# EAGLE design em18 (EAGLE 7.4.0)
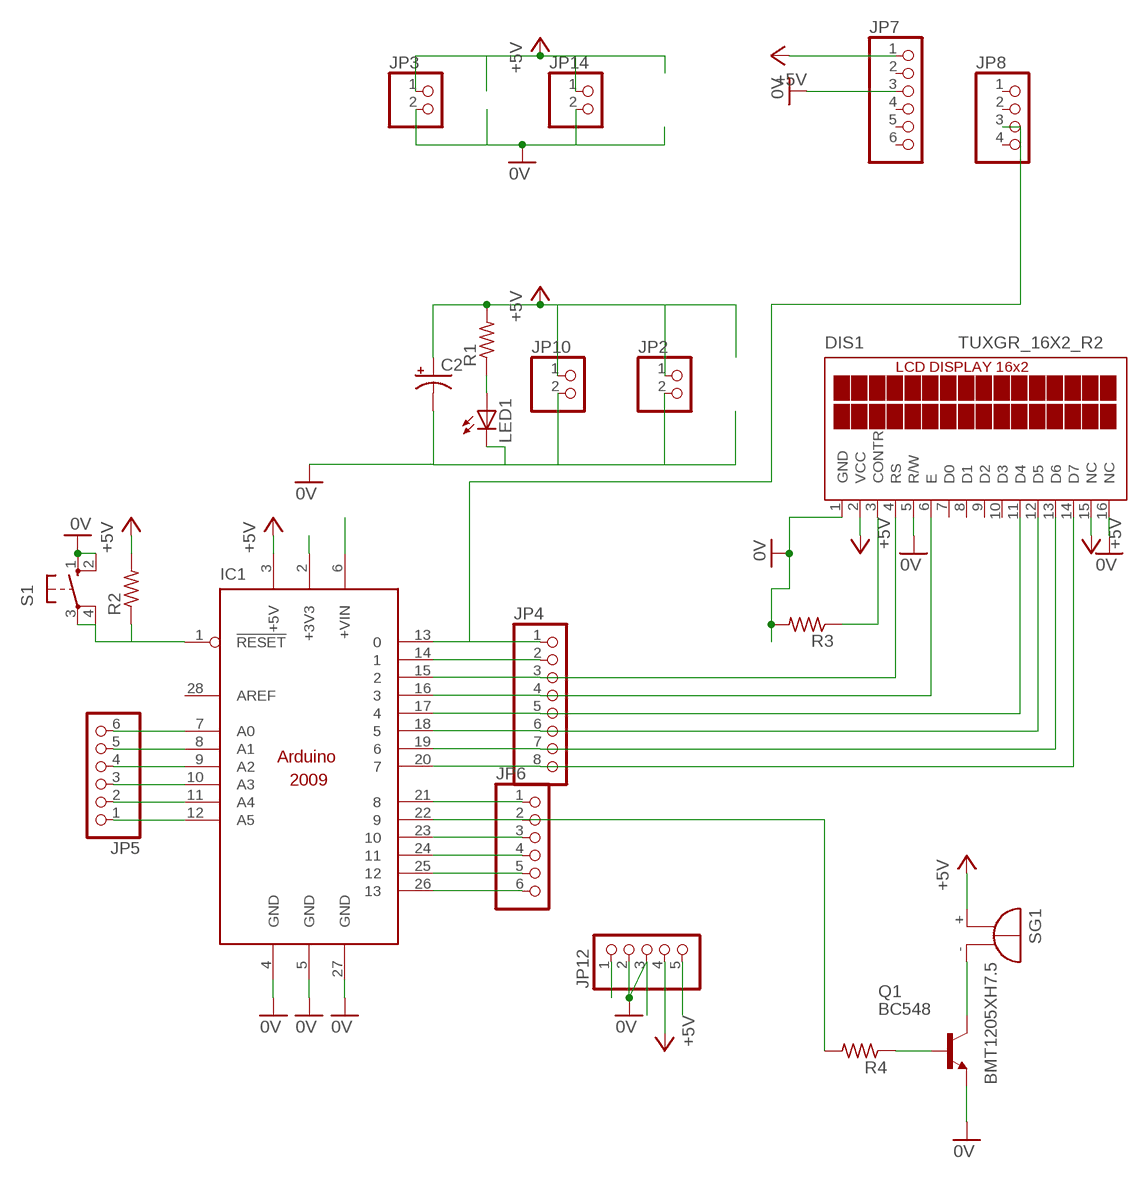
[diagram p0: schematic, sheet 1]

## Parts
C2  CPOL-USE3.5-10  [E3,5-10]
DIS1  TUXGR_16X2_R2  [TUXGR_16X2_R2]
IC1  ARDUINO2009_10  [ARDUINO2009]
JP2  PINHD-1X2  [1X02]
JP3  PINHD-1X2  [1X02]
JP4  PINHD-1X8  [1X08]
JP5  PINHD-1X6  [1X06]
JP6  PINHD-1X6  [1X06]
JP7  PINHD-1X6  [1X06]
JP8  PINHD-1X4  [1X04]
JP10  PINHD-1X2  [1X02]
JP12  PINHD-1X5  [1X05]
JP14  PINHD-1X2  [1X02]
LED1  LED3MM  [LED3MM]
Q1  BC548  [TO92-EBC]
R1  R-US_0207/7  [0207/7]
R2  R-US_0207/7  [0207/7]
R3  R-US_0207/7  [0207/7]
R4  R-US_0207/7  [0207/7]
S1  10-XX  [B3F-10XX]
SG1  BMT1205XH7.5  [BMT1205XH7.5]

## Nets
+5V: C2.+ DIS1.2(VCC) DIS1.15(NC) IC1.3(+5V) JP2.1 JP3.1 JP7.1 JP10.1 JP12.4 JP14.1 R1.2 R2.2 SG1.+
N$2: C2.- DIS1.1(GND) DIS1.5(R/W) DIS1.16(NC) IC1.4(GND) IC1.5(GND) IC1.27(GND) JP2.2 JP3.2 JP7.3 JP10.2 JP12.2 JP12.3 JP14.2 LED1.K(C) Q1.E R3.2 S1.1(S) S1.2(S1) ; supply symbol labelled 0V
N$3: IC1.2(+3V3) JP12.5
N$5: Q1.C SG1.-
N$6: Q1.B R4.1
N$7: LED1.A R1.1
N$8: IC1.1(!RESET) R2.1 S1.3(P) S1.4(P1)
N$9: IC1.6(+VIN) JP12.1
N$10: IC1.13 JP4.1 JP8.3
N$11: IC1.14 JP4.2
N$18: IC1.12(A5) JP5.1
N$19: IC1.11(A4) JP5.2
N$20: IC1.10(A3) JP5.3
N$21: IC1.9(A2) JP5.4
N$22: IC1.8(A1) JP5.5
N$23: IC1.7(A0) JP5.6
N$24: IC1.21 JP6.1
N$25: IC1.22 JP6.2 R4.2
N$26: IC1.23 JP6.3
N$27: IC1.24 JP6.4
N$28: IC1.25 JP6.5
N$29: IC1.26 JP6.6
N$30: DIS1.3(CONTR) R3.1
N$33: DIS1.4(RS) IC1.15 JP4.3
N$34: DIS1.6(E) IC1.16 JP4.4
N$35: DIS1.11(D4) IC1.17 JP4.5
N$36: DIS1.12(D5) IC1.18 JP4.6
N$37: DIS1.13(D6) IC1.19 JP4.7
N$38: DIS1.14(D7) IC1.20 JP4.8
Unconnected: DIS1.7(D0) DIS1.8(D1) DIS1.9(D2) DIS1.10(D3) IC1.28(AREF) JP7.2 JP7.4 JP7.5 JP7.6 JP8.1 JP8.2 JP8.4

## Library data of the parts
C2 = rcl:CPOL-US: POLARIZED CAPACITOR, American symbol
DIS1 = display-lcd:TUXGR_16X2_R2: Tuxgraphics LCD display 16x2 characters reflective, without background light Source: tuxgr_12x2_r2.pdf; OC_FARNELL: unknown; OC_NEWARK: unknown
IC1 = arduino:ARDUINO2009_1: The Arduino Duemilanove ("2009") is a microcontroller board based on the ATmega168 or ATmega328. - 14 digital input/output pins (of which 6 can be used as PWM outputs) - 6 analog inputs, a 16 MHz crystal oscillator - USB connection - power jack - ISP header - reset button It contains everything needed to support the microcontroller; simply connect it to a computer with a USB cable or power it with a AC-to-DC adapter or battery to get started http://arduino.cc/en/Main/ArduinoBoardDuemilanove
JP2 JP3 JP10 JP14 = pinhead:PINHD-1X2: PIN HEADER
JP4 = pinhead:PINHD-1X8: PIN HEADER
JP5-JP7 = pinhead:PINHD-1X6: PIN HEADER
JP8 = pinhead:PINHD-1X4: PIN HEADER
JP12 = pinhead:PINHD-1X5: PIN HEADER
LED1 = led:LED: LED OSRAM: - CHIPLED LG R971, LG N971, LY N971, LG Q971, LY Q971, LO R971, LY R971 LH N974, LH R974 LS Q976, LO Q976, LY Q976 LO Q996 - Hyper CHIPLED LW Q18S LB Q993, LB Q99A, LB R99A - SideLED LS A670, LO A670, LY A670, LG A670, LP A670 LB A673, LV A673, LT A673, LW A673 LH A674 LY A675 LS A676, LA A676, LO A676, LY A676, LW A676 LS A679, LY A679, LG A679 - Hyper Micro SIDELED® LS Y876, LA Y876, LO Y876, LY Y876 LT Y87S - SmartLED LW L88C, LW L88S LB L89C, LB L89S, LG L890 LS L89K, LO L89K, LY L89K LS L896, LA L896, LO L896, LY L896 - TOPLED LS T670, LO T670, LY T670, LG T670, LP T670 LSG T670, LSP T670, LSY T670, LOP T670, LYG T670 LG T671, LOG T671, LSG T671 LB T673, LV T673, LT T673, LW T673 LH T674 LS T676, LA T676, LO T676, LY T676, LB T676, LH T676, LSB T676, LW T676 LB T67C, LV T67C, LT T67C, LS T67K, LO T67K, LY T67K, LW E67C LS E67B, LA E67B, LO E67B, LY E67B, LB E67C, LV E67C, LT E67C LW T67C LS T679, LY T679, LG T679 LS T770, LO T770, LY T770, LG T770, LP T770 LB T773, LV T773, LT T773, LW T773 LH T774 LS E675, LA E675, LY E675, LS T675 LS T776, LA T776, LO T776, LY T776, LB T776 LHGB T686 LT T68C, LB T68C - Hyper Mini TOPLED® LB M676 - Mini TOPLED Santana® LG M470 LS M47K, LO M47K, LY M47K Source: http://www.osram.convergy.de LUXEON: - LUMILED® LXK2-PW12-R00, LXK2-PW12-S00, LXK2-PW14-U00, LXK2-PW14-V00 LXK2-PM12-R00, LXK2-PM12-S00, LXK2-PM14-U00 LXK2-PE12-Q00, LXK2-PE12-R00, LXK2-PE12-S00, LXK2-PE14-T00, LXK2-PE14-U00 LXK2-PB12-K00, LXK2-PB12-L00, LXK2-PB12-M00, LXK2-PB14-N00, LXK2-PB14-P00, LXK2-PB14-Q00 LXK2-PR12-L00, LXK2-PR12-M00, LXK2-PR14-Q00, LXK2-PR14-R00 LXK2-PD12-Q00, LXK2-PD12-R00, LXK2-PD12-S00 LXK2-PH12-R00, LXK2-PH12-S00 LXK2-PL12-P00, LXK2-PL12-Q00, LXK2-PL12-R00 Source: www.luxeon.com KINGBRIGHT: KA-3528ASYC Source: www.kingbright.com
Q1 = transistor-npn:BC548*: NPN Transistor
R1-R4 = rcl:R-US_: RESISTOR, American symbol
S1 = switch-omron:10-XX: OMRON SWITCH; MPN: B3F-1000; OC_FARNELL: 176432; OC_NEWARK: 36M3542
SG1 = buzzer:BMT1205XH7.5: MAGNETIC TRANSDUCER Source: Http:www.be-star.com; OC_FARNELL: unknown; OC_NEWARK: unknown

## Board
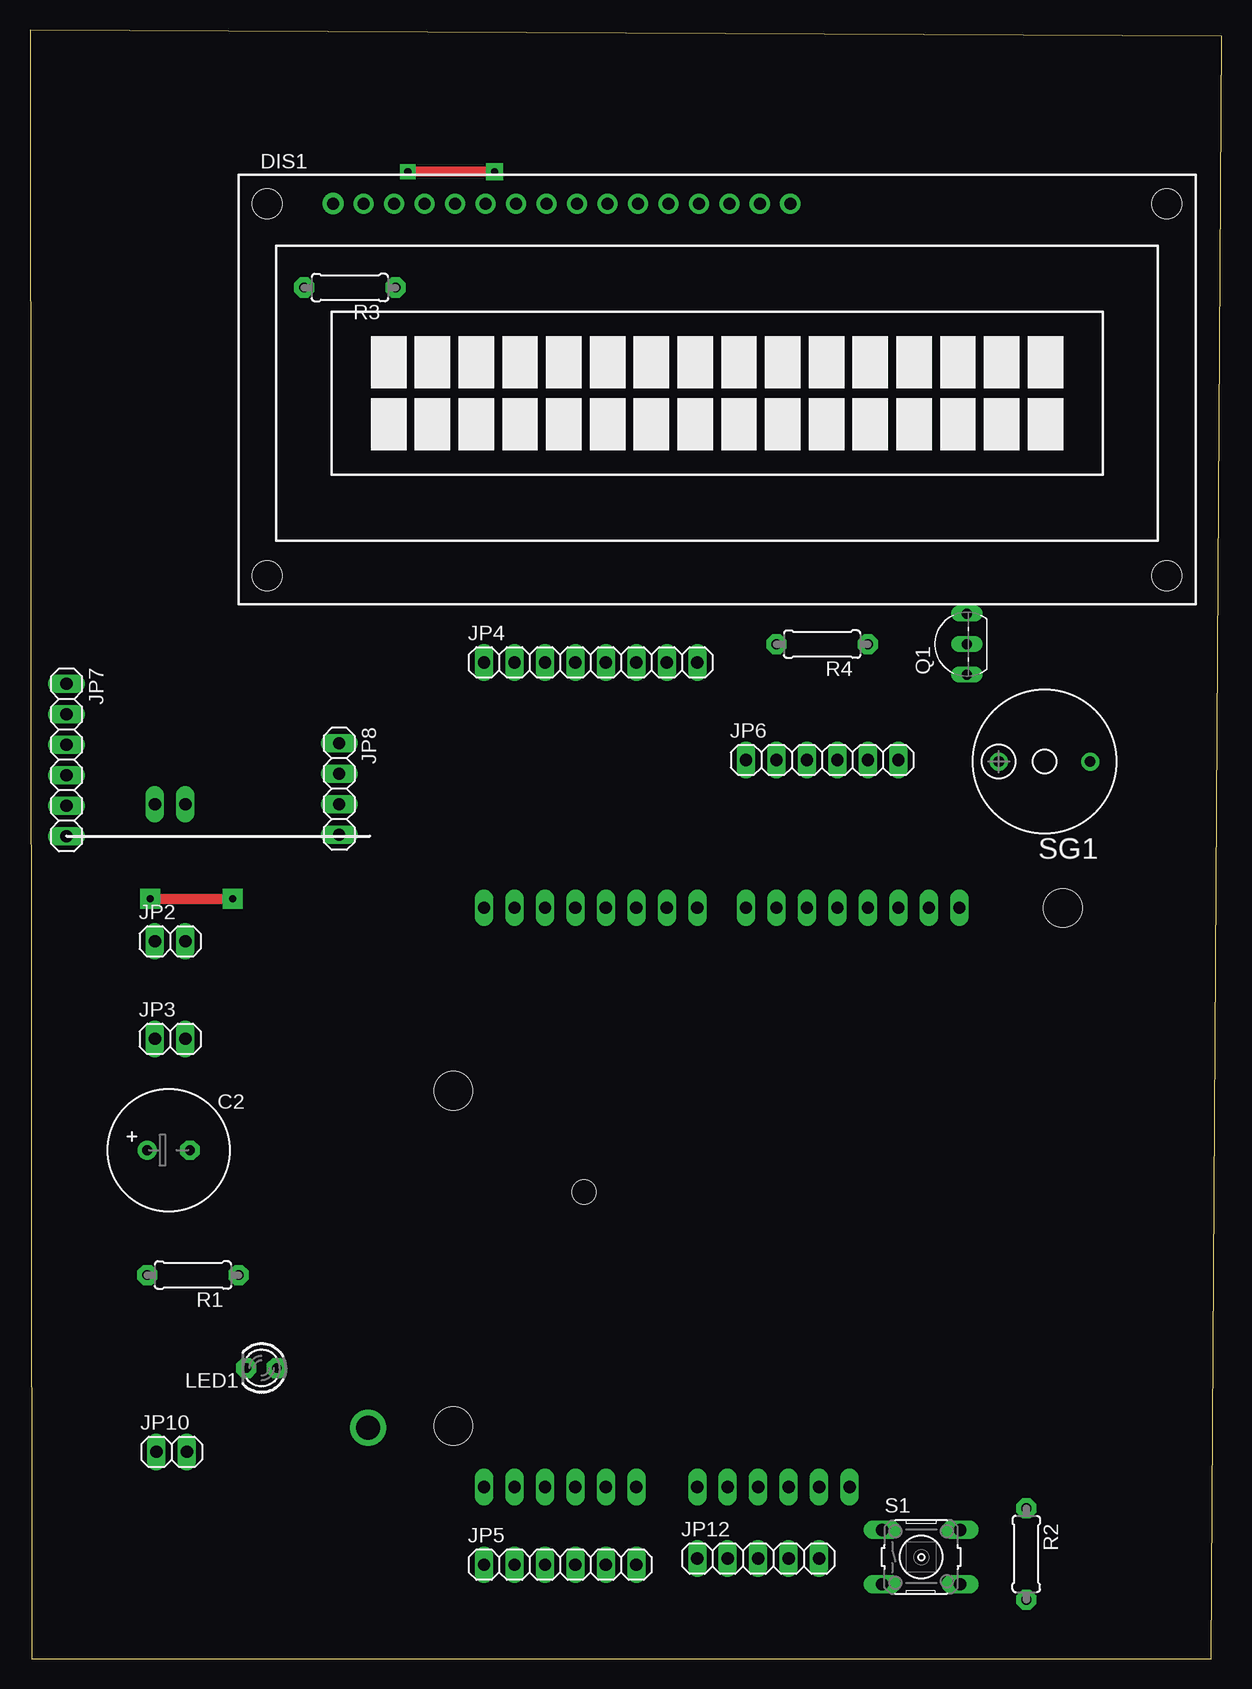
[diagram p1: board, top side]
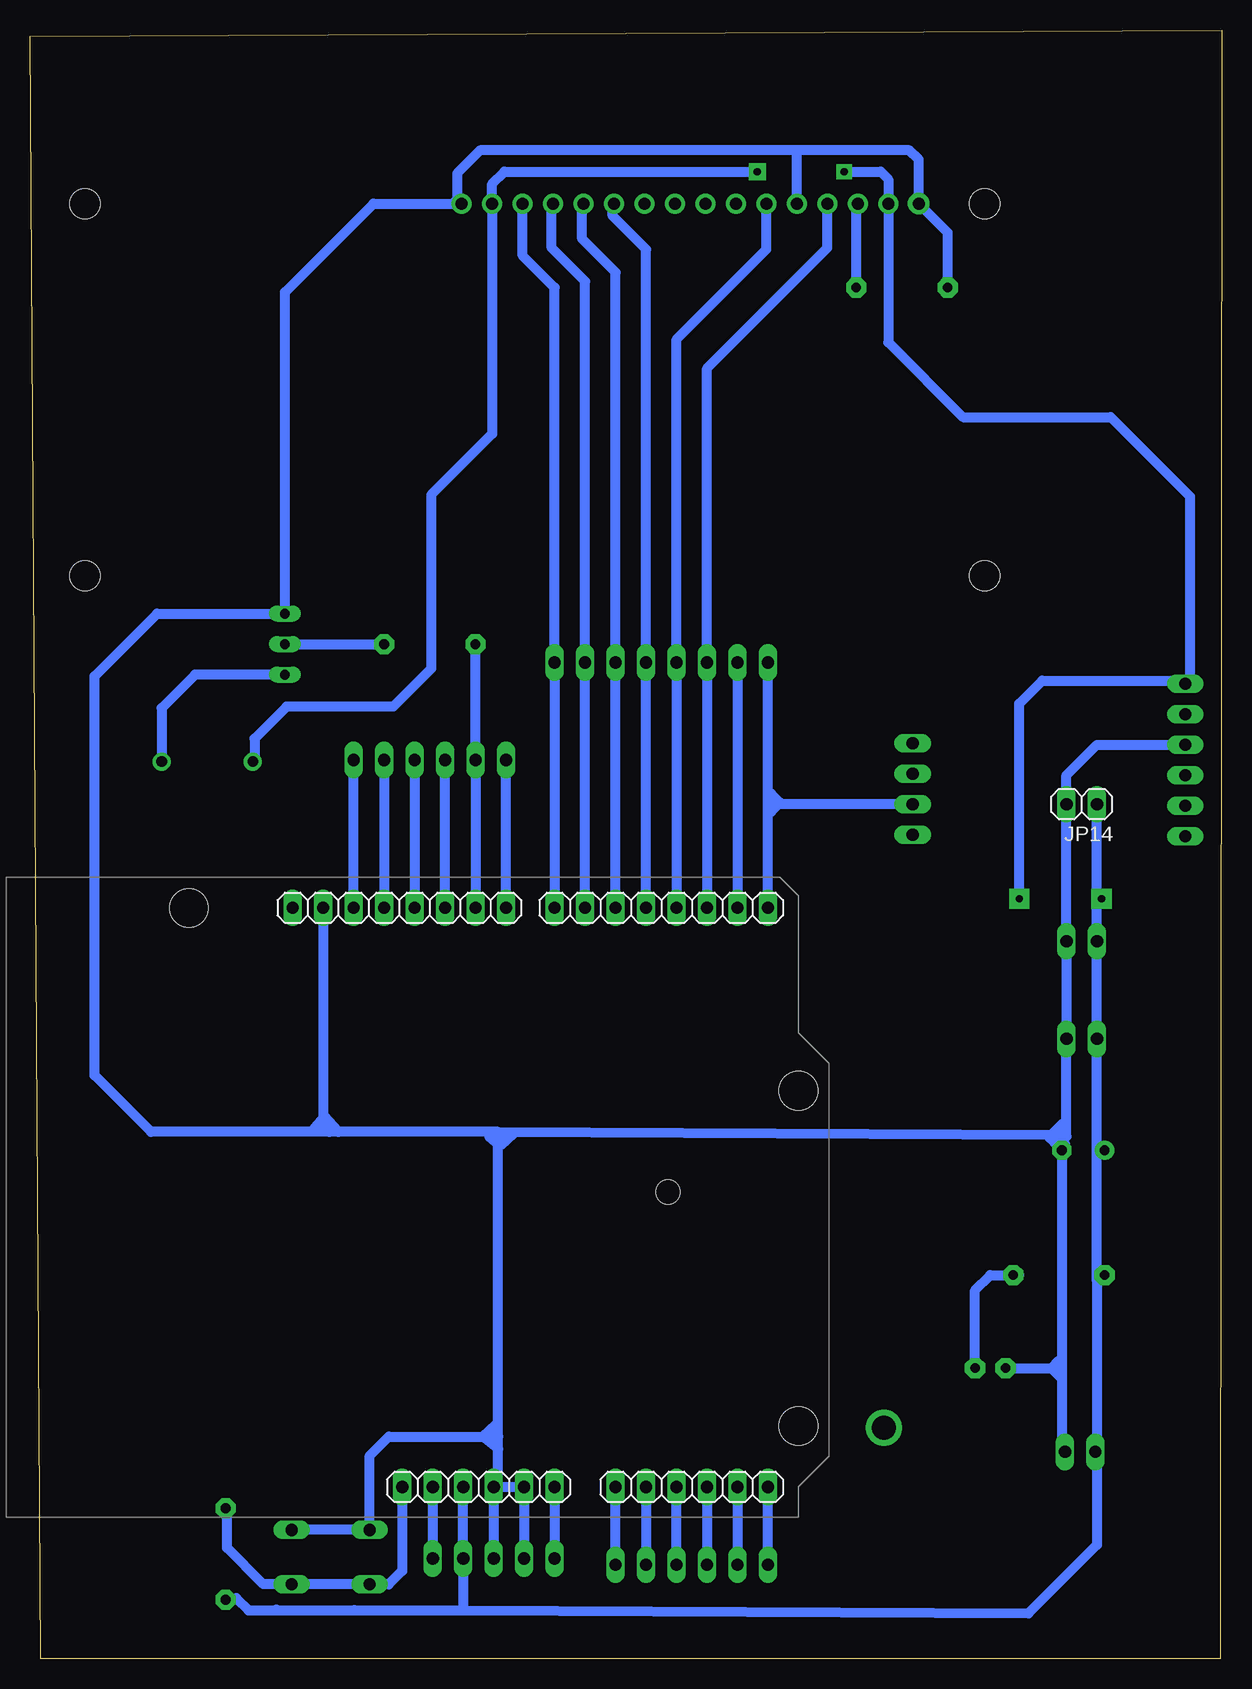
[diagram p2: board, bottom side, seen from below]

Size 99.37 x 135.74 mm. Coordinates in mm from the lower left corner, seen from the top.
Outline: 0,135.74 0.13,0 98.48,0 99.37,135.23 0,135.74
Copper layers (1*16): Top 0.035mm / dielectric 1.5mm / Bottom 0.035mm
Design rules "default": minimum track width 10mil, minimum drill 24mil, track to track 8mil, track to pad 8mil, pad to pad 8mil, via to via 8mil, smd to smd 8mil, copper to edge 40mil, drill to drill 8mil, minimum pad ring 10mil, minimum via ring 8mil, stop-mask expansion 4mil, vias tented up to drill 0mil, thermal gap 10mil

### Footprints (pad centres in the part's own frame; a part is rotated, then mirrored left to right if it is on the bottom)
E3,5-10 = drill 0.813 pad 1.6: + -1.778,0 | drill 0.813 pad 1.6 octagon: - 1.778,0
TUXGR_16X2_R2 = drill 1 pad 1.778: 1 -32,15.5 | drill 1 pad 1.676: 2 -29.46,15.5; 3 -26.92,15.5; 4 -24.38,15.5; 5 -21.84,15.5; 6 -19.3,15.5; 7 -16.76,15.5; 8 -14.22,15.5; 9 -11.68,15.5; 10 -9.14,15.5; 11 -6.6,15.5; 12 -4.06,15.5; 13 -1.52,15.5; 14 1.02,15.5; 15 3.56,15.5; 16 6.1,15.5 | hole 2.5: -37.5,-15.5; 37.5,-15.5; -37.5,15.5; 37.5,15.5
ARDUINO2009 = drill 1.016 long: 1 33.02,2.54; 2 35.56,2.54; 3 38.1,2.54; 4 40.64,2.54; 5 43.18,2.54; 6 45.72,2.54; 7 50.8,2.54; 8 53.34,2.54; 9 55.88,2.54; 10 58.42,2.54; 11 60.96,2.54; 12 63.5,2.54; 13 63.5,50.8; 14 60.96,50.8; 15 58.42,50.8; 16 55.88,50.8; 17 53.34,50.8; 18 50.8,50.8; 19 48.26,50.8; 20 45.72,50.8; 21 41.656,50.8; 22 39.116,50.8; 23 36.576,50.8; 24 34.036,50.8; 25 31.496,50.8; 26 28.956,50.8; 27 26.416,50.8; 28 23.876,50.8 | hole 3.2: 15.24,50.8; 66.04,35.56; 66.04,7.62 | hole 2: 55.17,27.114
1X02 = drill 1.016 long: 1 -1.27,0; 2 1.27,0
1X08 = drill 1.016 long: 1 -8.89,0; 2 -6.35,0; 3 -3.81,0; 4 -1.27,0; 5 1.27,0; 6 3.81,0; 7 6.35,0; 8 8.89,0
1X06 = drill 1.016 long: 1 -6.35,0; 2 -3.81,0; 3 -1.27,0; 4 1.27,0; 5 3.81,0; 6 6.35,0
1X04 = drill 1.016 long: 1 -3.81,0; 2 -1.27,0; 3 1.27,0; 4 3.81,0
1X05 = drill 1.016 long: 1 -5.08,0; 2 -2.54,0; 3 0,0; 4 2.54,0; 5 5.08,0
LED3MM = drill 0.813 pad 1.676 octagon: A -1.27,0; K 1.27,0
TO92-EBC = drill 0.813 long: B 0,-1.27; C -2.54,-1.27; E 2.54,-1.27
0207/7 = drill 0.813 pad 1.676 octagon: 1 -3.81,0; 2 3.81,0
B3F-10XX = drill 1.016 long: 1 -3.251,2.261; 2 3.251,2.261; 3 -3.251,-2.261; 4 3.251,-2.261
BMT1205XH7.5 = drill 0.9 pad 1.5: + 3.8,0; - -3.8,0

### Placement (x,y rotation side)
C2  11.56,42.4 0 top
DIS1  57.28,105.77 0 top
IC1  101.35,11.79 0 bottom
JP2  11.68,59.8 0 top
JP3  11.68,51.67 0 top
JP4  46.74,83.04 0 top
JP5  44.2,7.85 0 top
JP6  66.04,74.91 0 top
JP7  3.05,74.91 270 top
JP8  25.78,72.5 270 top
JP10  11.81,17.25 0 top
JP12  60.71,8.36 0 top
JP14  11.68,71.23 180 bottom
LED1  19.3,24.24 180 top
Q1  76.84,84.56 90 top
R1  13.59,31.98 180 top
R2  83.06,8.74 270 top
R3  26.67,114.28 180 top
R4  66.04,84.56 180 top
S1  74.3,8.49 0 top
SG1  84.58,74.78 180 top

### Tracks (layer width: path | path; a pad name or v marks a point on that pad's centre or on a via)
+5V  (via drill 0.6 pad 1.27, 0.6 pad 1.42, 0.6 pad 1.68)
  Top 0.813: v10.03,63.35 v16.89,63.35 | v38.73,123.93 v31.5,123.93
  Bottom 0.813: IC1.3 JP12.4 63.25,4.17 63.12,4.04 | R2.2 82.17,5.06 81.15,4.04 78.74,4.04 | 78.74,4.04 72.26,4.04 | 72.31,4.09 72.26,4.04 | 78.82,4.12 78.74,4.04 | 72.26,4.04 63.12,4.04 | 63.12,4.04 16.13,3.79 10.41,9.51 10.41,17 | 10.41,31.48 10.41,42.4 | 10.41,42.4 JP3.1 JP2.1 10.41,63.35 | R1.2 10.03,31.86 10.41,31.48 | C2.+ 10.41,42.4 | v16.89,63.35 16.89,79.61 14.99,81.51 3.3,81.51 JP7.1 2.67,81.64 2.67,96.88 9.27,103.48 21.59,103.48 27.82,109.71 DIS1.2 27.81,123.3 28.45,123.93 v31.5,123.93 | v38.73,123.93 59.82,123.93 60.84,122.91 DIS1.15 60.84,102.08 65.91,97.01 65.91,82.53 69.09,79.36 77.98,79.36 80.65,76.69 80.65,74.92 SG1.+ | 10.41,63.35 JP14.1 | v10.03,63.35 10.41,63.35 | 10.41,31.48 10.41,17 | JP10.1 10.54,17.12 10.41,17
N$2
  Bottom 0.813: IC1.4 JP12.3 | JP12.2 IC1.5 IC1.4 | 60.33,43.92 13.97,43.67 | 13.84,43.67 13.08,43.67 12.95,43.54 JP3.2 JP2.2 JP14.2 12.95,73.64 10.41,76.18 JP7.3 | 13.08,44.56 13.97,43.67 | 13.97,43.67 13.84,43.67 | 13.84,43.67 13.08,42.91 13.08,42.65 C2.- 13.34,24.24 | IC1.4 60.33,14.33 60.33,17.51 | 60.33,17.51 60.33,18.52 | 60.33,18.52 60.33,43.92 | 35.31,125.71 26.04,125.71 25.28,124.95 DIS1.1 22.86,118.85 R3.2 | 35.31,125.71 61.85,125.71 63.75,123.81 63.75,121.65 | 63.75,121.65 DIS1.16 | DIS1.5 35.44,125.58 35.31,125.71 | 61.59,18.52 69.47,18.52 71.04,16.95 S1.1 S1.2 | 61.59,18.52 60.33,18.52 | 60.33,43.92 73.66,43.92 | 73.66,43.92 74.42,43.92 | IC1.27 74.93,44.43 74.42,43.92 | 13.34,24.24 13.34,23.35 | 13.34,23.35 13.34,17.51 JP10.2 | LED1.K 14.22,24.24 | 14.22,24.24 13.34,24.24 | 13.34,23.35 14.22,24.24 | 14.22,24.24 13.59,24.87 | 73.66,43.92 74.8,45.19 75.69,44.18 | 60.33,17.51 61.59,18.52 | 61.59,18.52 60.45,19.54 | 74.42,43.92 89.28,43.92 93.98,48.62 93.98,81.89 88.77,87.1 Q1.E 78.11,113.9 70.74,121.26 64.14,121.26 63.75,121.65
N$3
  Bottom 0.813: IC1.2 JP12.5
N$4  (via drill 2 pad 2.18)
  other vias: 28.19,19.28
N$5
  Bottom 0.813: Q1.C 85.6,82.02 88.39,79.23 88.39,74.79 SG1.-
N$6
  Bottom 0.813: Q1.B R4.1
N$7
  Bottom 0.813: LED1.A 20.57,30.71 19.3,31.98 R1.1 16.89,31.98
N$8
  Bottom 0.813: IC1.1 68.33,7.35 69.47,6.2 71.02,6.2 S1.3 S1.4 79.91,6.23 82.93,9.25 82.93,12.43 R2.1
N$9
  Bottom 0.813: IC1.6 JP12.1
N$10
  Bottom 0.813: IC1.13 37.85,71.23 | 37.85,71.23 JP4.1 | 37.85,71.23 37.59,71.48 37.34,71.23 JP8.3
N$11
  Bottom 0.813: JP4.2 IC1.14
N$12
  Bottom 0.813: 13.72,42.52 13.72,42.78 14.35,43.41 14.35,43.54 13.34,44.56
N$13
  Bottom 0.813: 59.05,43.8 60.2,42.78 61.09,43.54
N$14
  Bottom 0.813: 37.72,70.59 37.59,70.59 36.83,71.35 37.59,72.12
N$18
  Bottom 0.813: JP5.1 IC1.12
N$19
  Bottom 0.813: IC1.11 JP5.2
N$20
  Bottom 0.813: IC1.10 JP5.3
N$21
  Bottom 0.813: JP5.4 IC1.9
N$22
  Bottom 0.813: IC1.8 JP5.5
N$23
  Bottom 0.813: JP5.6 IC1.7
N$24
  Bottom 0.813: IC1.21 JP6.1
N$25
  Bottom 0.813: IC1.22 JP6.2 R4.2
N$26
  Bottom 0.813: IC1.23 JP6.3
N$27
  Bottom 0.813: JP6.4 IC1.24
N$28
  Bottom 0.813: JP6.5 IC1.25
N$29
  Bottom 0.813: IC1.26 JP6.6
N$30
  Bottom 0.813: R3.1 30.48,121.15 DIS1.3
N$33
  Bottom 0.813: IC1.15 JP4.3 42.93,107.55 32.89,117.58 DIS1.4
N$34
  Bottom 0.813: IC1.16 JP4.4 45.47,109.96 37.97,117.46 DIS1.6
N$35
  Bottom 0.813: IC1.17 JP4.5 48.01,117.46 50.8,120.25 50.8,121.15 DIS1.11
N$36
  Bottom 0.813: IC1.18 JP4.6 50.55,115.55 53.34,118.34 53.34,121.15 DIS1.12
N$37
  Bottom 0.813: IC1.19 JP4.7 53.09,114.79 55.88,117.58 55.88,121.15 DIS1.13
N$38
  Bottom 0.813: IC1.20 JP4.8 55.63,114.28 58.29,116.95 DIS1.14